# EasyEDA schematic 04-ES8311-PA.json
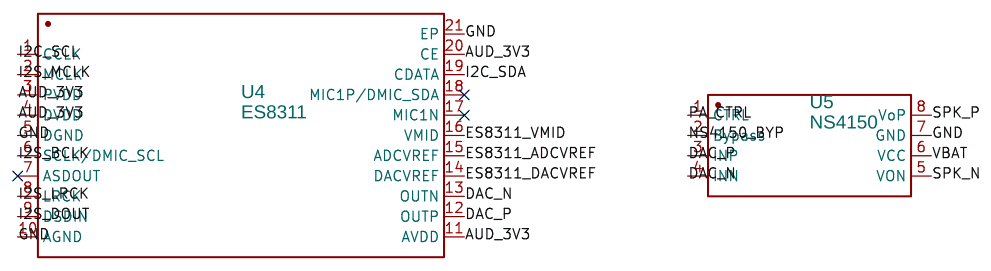
[diagram p0: schematic sheet]

## Parts
U4  ES8311  [WQFN-20_L3.0-W3.0-P0.40-BL-EP1.7]
U5  NS4150  [MSOP-8_L3.0-W3.0-P0.65-LS5.0-BL]

## Library data of the parts
U4 = -: Contributor: LCSC; Supplier: LCSC; Supplier Part: C962342; Manufacturer: Everest-semi(); JLCPCB Part Class: Extended Part
U5 = -: Contributor: LCSC; Supplier: LCSC; Supplier Part: C189961; Manufacturer: Nsiway(); Manufacturer Part: NS4150B; JLCPCB Part Class: Extended Part

## Nets
GND: U4.5(DGND) U4.10(AGND) U4.21(EP) U5.7(GND)
VBAT: U5.6(VCC)
AUD_3V3: U4.3(PVDD) U4.4(DVDD) U4.11(AVDD) U4.20(CE)
DAC_N: U4.13(OUTN) U5.4(INN)
DAC_P: U4.12(OUTP) U5.3(INP)
ES8311_ADCVREF: U4.15(ADCVREF)
ES8311_DACVREF: U4.14(DACVREF)
ES8311_VMID: U4.16(VMID)
I2C_SCL: U4.1(CCLK)
I2C_SDA: U4.19(CDATA)
I2S_BCLK: U4.6(SCLK/DMIC_SCL)
I2S_DOUT: U4.9(DSDIN)
I2S_LRCK: U4.8(LRCK)
I2S_MCLK: U4.2(MCLK)
NS4150_BYP: U5.2(Bypass)
PA_CTRL: U5.1(CTRL)
SPK_N: U5.5(VON)
SPK_P: U5.8(VoP)

Not connected (* = marked no-connect by the designer): U4 7(ASDOUT)* 17(MIC1N)* 18(MIC1P/DMIC_SDA)*

## Notes on the sheet
- MEB AI Asistan - 4/5  ES8311 + NS4150 hoparlor
- DSDIN <- I2S_DOUT (GPIO8). PA_CTRL = GPIO46, boot'ta LOW (10k pulldown). Adres 0x18.
- OUTP/OUTN -> NS4150 IN. Hoparlor 8 ohm. PVDD = VBAT.
